# EAGLE design force_sensor_pcb_v2 (EAGLE 9.2.2)
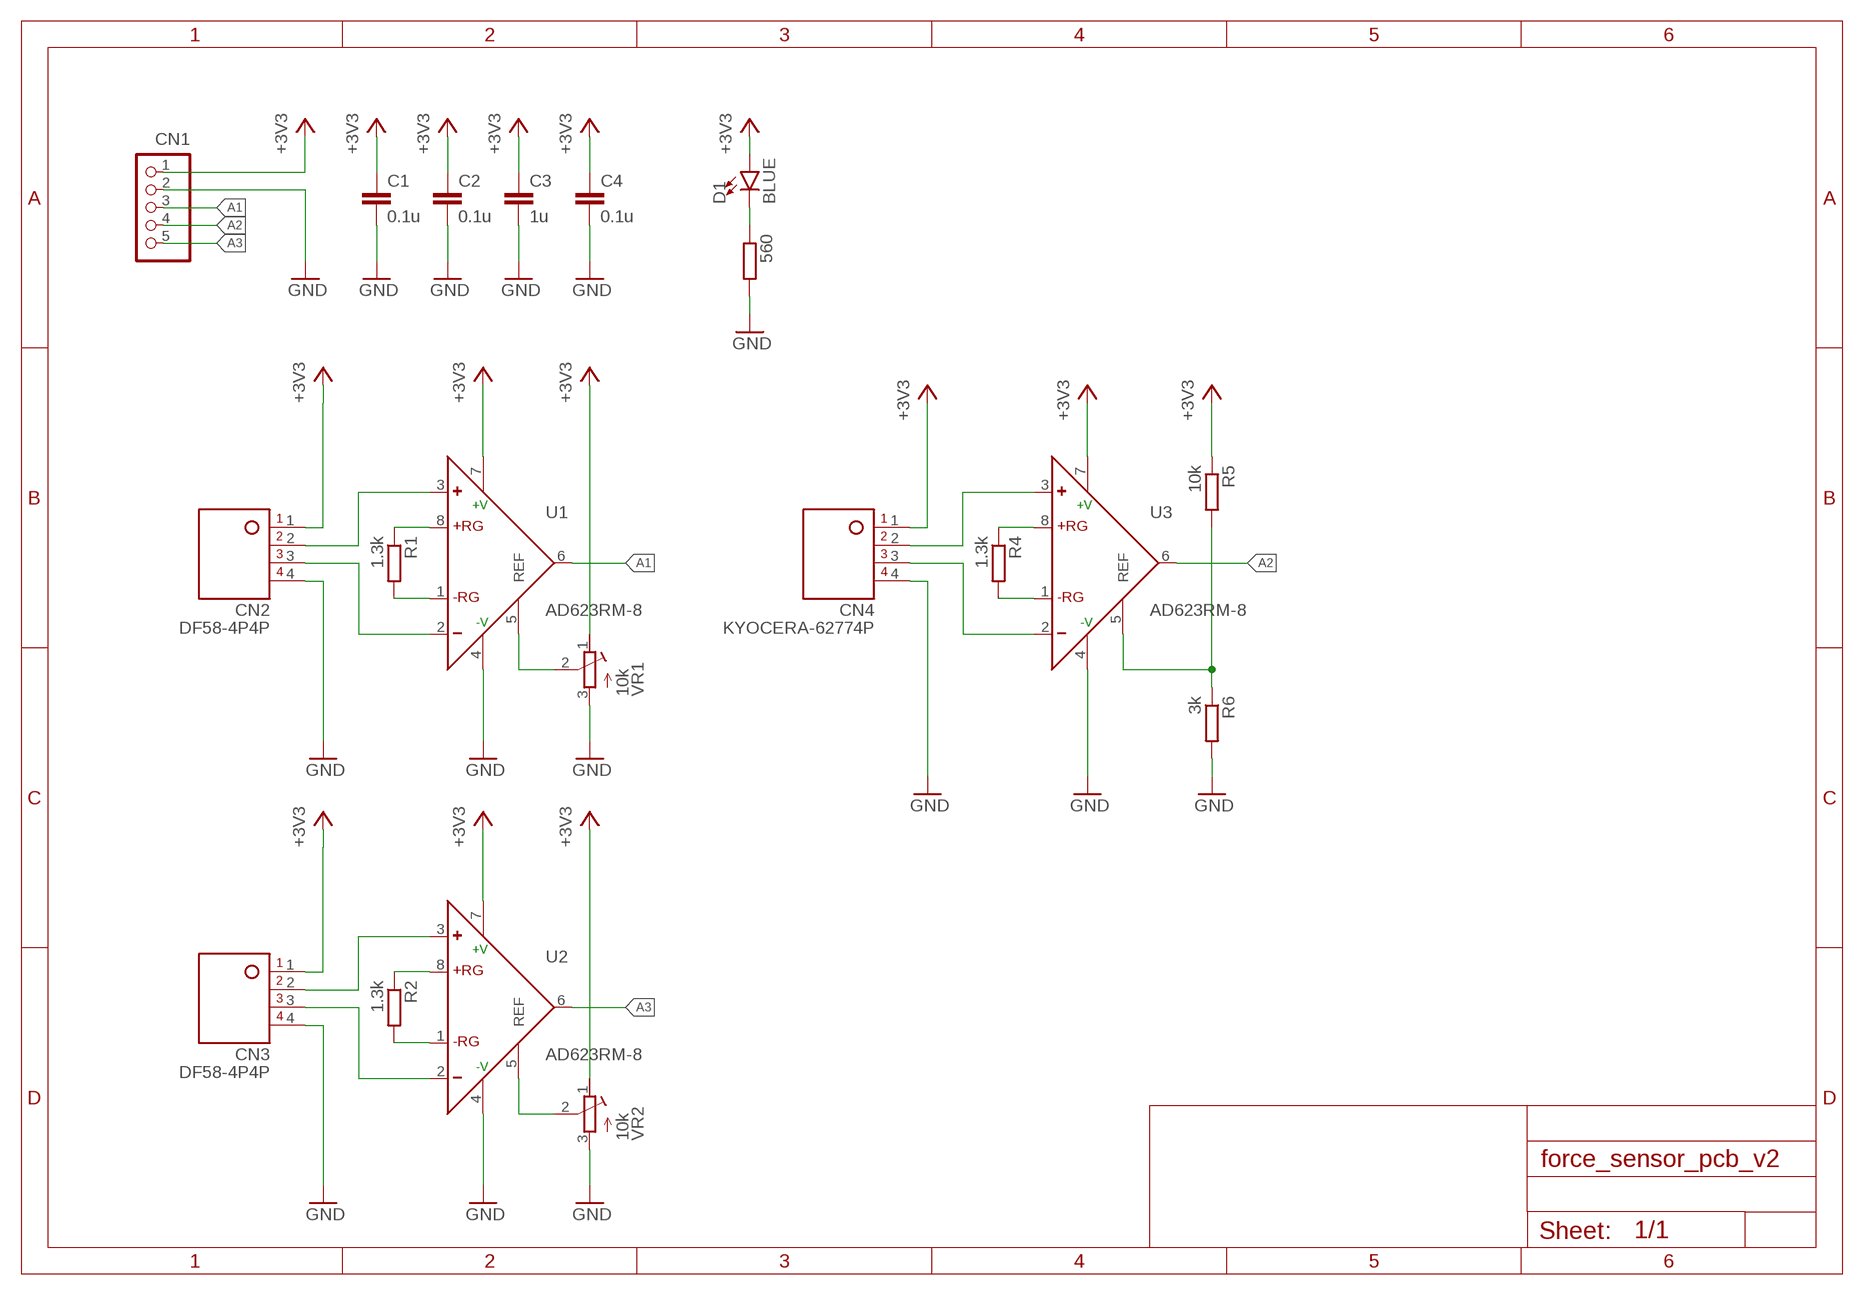
[diagram p0: schematic, sheet 1]

## Parts
560  R-EU_R0603  [R0603]
C1  0.1u  C-EUC0603  [C0603]
C2  0.1u  C-EUC0603  [C0603]
C3  1u  C-EUC0603  [C0603]
C4  0.1u  C-EUC0603  [C0603]
CN1  B5B-PH-K-S  [B5B-PH-K-S]
CN2  DF58-4P4P  [DF58-4P]
CN3  DF58-4P4P  [DF58-4P]
CN4  KYOCERA-62774P  [KYOCERA-6277-4]
D1  BLUE  LED-BLUE0603  [LED-0603]
R1  1.3k  R-EU_R0603  [R0603]
R2  1.3k  R-EU_R0603  [R0603]
R4  1.3k  R-EU_R0603  [R0603]
R5  10k  R-EU_R0603  [R0603]
R6  3k  R-EU_R0603  [R0603]
U1  AD623RM-8  [MSOP08]
U2  AD623RM-8  [MSOP08]
U3  AD623RM-8  [MSOP08]
VR1  10k  D43A  [D43A]
VR2  10k  D43A  [D43A]

## Nets
+3V3: C1.1 C2.1 C3.1 C4.1 CN1.1 CN2.1 CN3.1 CN4.1 D1.A R5.1 U1.7(+V) U2.7(+V) U3.7(+V) VR1.1 VR2.1
A1: CN1.3 U1.6(OUT)
A2: CN1.4 U3.6(OUT)
A3: CN1.5 U2.6(OUT)
GND: 560.2 C1.2 C2.2 C3.2 C4.2 CN1.2 CN2.4 CN3.4 CN4.4 R6.2 U1.4(-V) U2.4(-V) U3.4(-V) VR1.3 VR2.3
N$3: U1.5(REF) VR1.2
N$5: CN2.3 U1.2(-IN)
N$6: R1.1 U1.8(+RG)
N$7: R1.2 U1.1(-RG)
N$8: CN2.2 U1.3(+IN)
N$10: R2.1 U2.8(+RG)
N$11: U2.5(REF) VR2.2
N$12: CN3.3 U2.2(-IN)
N$13: CN3.2 U2.3(+IN)
N$14: R2.2 U2.1(-RG)
N$15: R4.1 U3.8(+RG)
N$16: R5.2 R6.1 U3.5(REF)
N$17: CN4.3 U3.2(-IN)
N$18: CN4.2 U3.3(+IN)
N$19: R4.2 U3.1(-RG)
N$20: 560.1 D1.C

## Library data of the parts
560 R1 R2 R4-R6 = rcl:R-EU_: RESISTOR, European symbol; SPICEPREFIX: R
C1-C4 = rcl:C-EU: CAPACITOR, European symbol; SPICEPREFIX: C
CN1 = jst-ph:B5B-PH-*: Wire-to-Board 2.0mm pitch top mount connector Source: http://www.jst-mfg.com/product/pdf/jpn/PH.pdf http://www.jst-mfg.com/product/detail.php?series=199
CN2 CN3 = yunit-tech_eagle_library:DF58-4P
CN4 = yunit-tech_eagle_library:KYOCERA-6277: 0.5mmピッチ RA STM 両面接点 ワンタッチロック
D1 = yunit-tech_eagle_library:LED-BLUE: Blue SMD LED Used in manufacturing of various products at SparkFun Packages: 0603 - SMD 0603 package [Product Link] <http://www.digikey.com/product-detail/en/SMLE12BC7TT86/511-1589-2-ND/1641808> 1206 - SMD1206 package [Product Link] <http://www.digikey.com/product-detail/en/lite-on-inc/LTST-C150TBKT/160-1643-1-ND/573584> SparkFun Products: ESP8266 Thing-Dev Board <https://www.sparkfun.com/products/13711> RedBoard <https://www.sparkfun.com/products/12757>; PROD_ID: DIO-08575
U1-U3 = yunit-tech_eagle_library:AD623
VR1 VR2 = yunit-tech_eagle_library:D43A

## Board
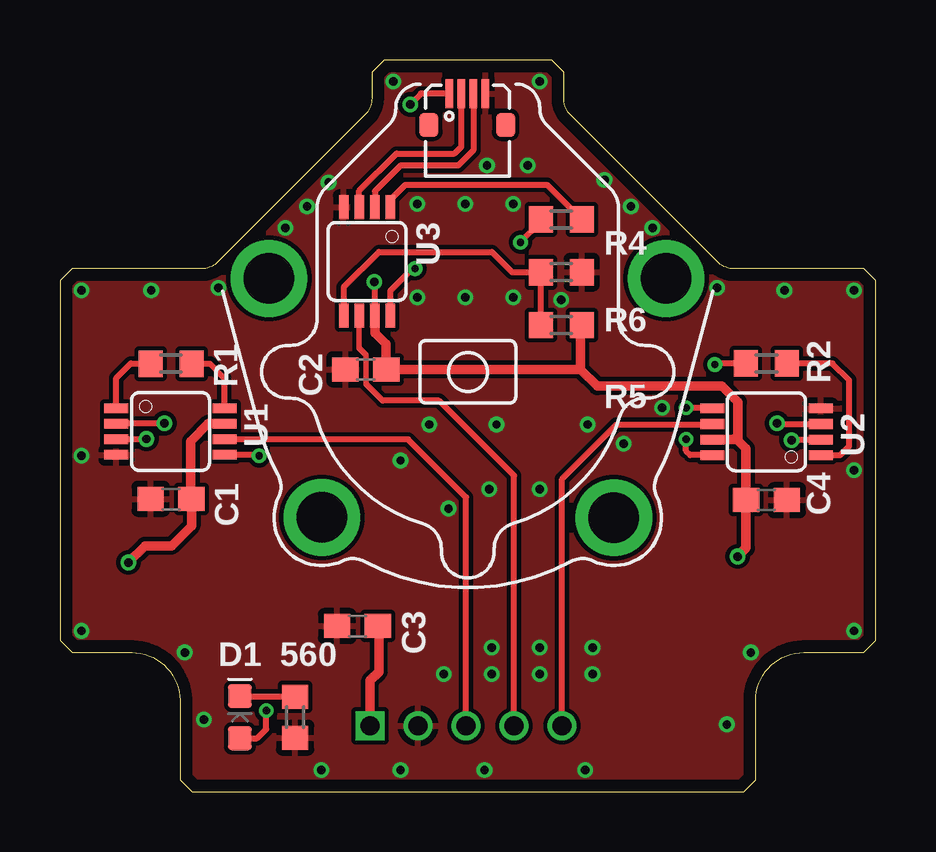
[diagram p1: board, top side]
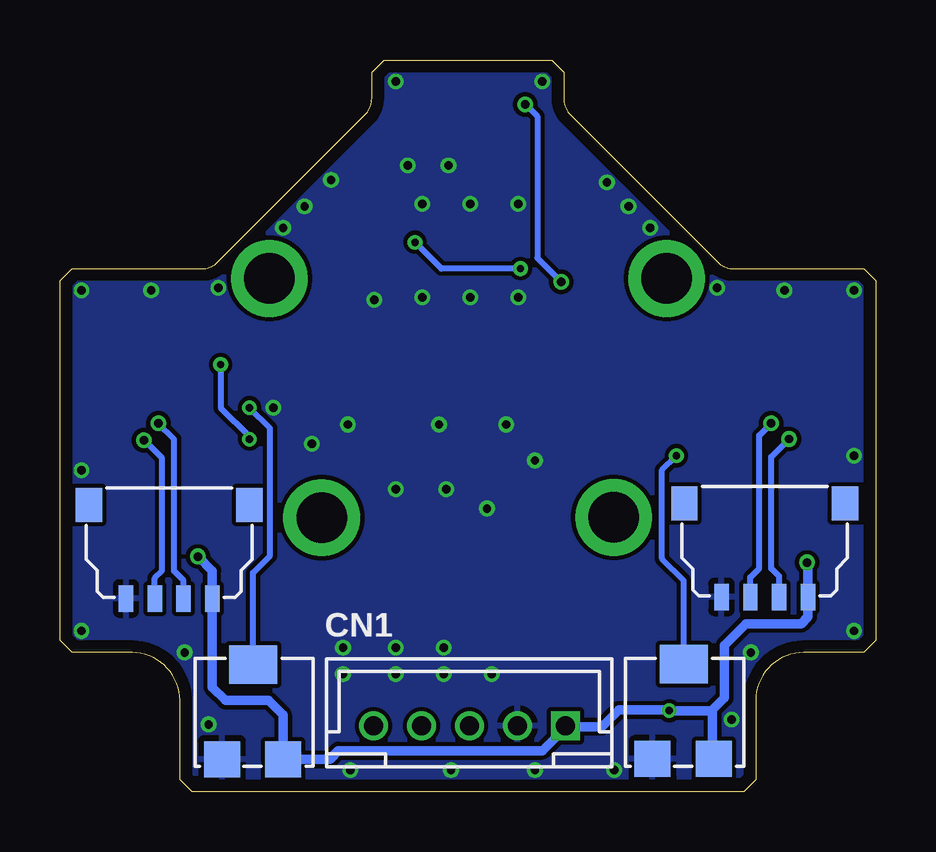
[diagram p2: board, bottom side, seen from below]

Size 34 x 30.5 mm. Coordinates in mm from the lower left corner, seen from the top.
Outline: 28.5,0 29,0.5 29,3.8 arc-90 31,5.8 33.5,5.8 34,6.3 34,21.3 33.5,21.8 28.11,21.8 arc-45 27.4,22.09 21.29,28.2 arc-45 21,28.91 21,30 20.5,30.5 13.5,30.5 13,30 13,28.91 arc-45 12.71,28.2 6.6,22.09 arc-45 5.89,21.8 0.5,21.8 0,21.3 0,6.3 0.5,5.8 3,5.8 arc-90 5,3.8 5,0.5 5.5,0 28.5,0
Copper layers (1*16): Top 0.035mm / dielectric 1.6mm / Bottom 0.035mm
Design rules "Elecrow_2-layer_PCB_eagle_rule": minimum track width 6mil, minimum drill 12mil, track to track 7mil, track to pad 7mil, pad to pad 7mil, via to via 8mil, smd to smd 0mil, copper to edge 20mil, drill to drill 10mil, minimum pad ring 6mil, minimum via ring 6mil, stop-mask expansion 0mil, vias tented up to drill 100mil, thermal gap 10mil

### Footprints (pad centres in the part's own frame; a part is rotated, then mirrored left to right if it is on the bottom)
R0603 = smd 1 x 1.1: 1 -0.85,0; 2 0.85,0
C0603 = smd 1.1 x 1: 1 -0.85,0; 2 0.85,0
B5B-PH-K-S = drill 0.8 square: 1 -4,0 | drill 0.8: 2 -2,0; 3 0,0; 4 2,0; 5 4,0
DF58-4P = smd 0.6 x 1.1: 1 -1.8,4.6; 2 -0.6,4.6; 3 0.6,4.6; 4 1.8,4.6 | smd 1.1 x 1.4: PAD1 -3.35,0.7; PAD2 3.35,0.7
KYOCERA-6277-4 = smd 0.3 x 1.2: 1 -0.75,1.3; 2 -0.25,1.3; 3 0.25,1.3; 4 0.75,1.3 | smd 0.8 x 1: PAD-1 -1.6,0; PAD-2 1.6,0
LED-0603 = smd 1 x 1: A -0.877,0; C 0.877,0
MSOP08 = smd 0.4 x 1: 1 -0.976,-2.263; 2 -0.326,-2.263; 3 0.324,-2.263; 4 0.974,-2.263; 5 0.974,2.262; 6 0.324,2.262; 7 -0.326,2.262; 8 -0.976,2.262
D43A = smd 1.5 x 1.5: 1 1.25,-1.95; 3 -1.3,-1.95 | smd 2 x 1.6: 2 0,2

### Placement (x,y rotation side)
560  9.8,3.1 270 top
C1  4.63,12.2 180 top
C2  12.75,17.6 180 top
C3  12.4,6.9 180 top
C4  29.45,12.15 0 top
CN1  16.93,2.74 180 bottom
CN2  4.62,12.71 180 bottom
CN3  29.45,12.65 180 bottom
CN4  16.98,27.8 0 top
D1  7.5,3.1 90 top
R1  4.63,17.84 180 top
R2  29.45,17.85 0 top
R4  20.9,23.85 0 top
R5  20.9,19.45 180 top
R6  20.9,21.65 0 top
U1  4.61,15.01 270 top
U2  29.45,15 90 top
U3  12.8,22.1 180 top
VR1  8,3.31 0 bottom
VR2  25.95,3.3 0 bottom

### Tracks (layer width: path | path; a pad name or v marks a point on that pad's centre or on a via)
+3V3  (via drill 0.3, 0.35)
  Top 0.25: CN4.1 15.05,29.1 v14.6,28.65 | U3.7 13.13,21.22 v13.1,21.25 | D1.A 8.22,2.22 8.6,2.6 v8.6,3.37
  Top 0.4: U2.7 28.11,14.67 28.17,14.73 28.27,14.63 | 28.27,14.63 28.6,14.3 C4.1 28.6,10.15 v28.25,9.8 | U3.7 13.13,19.12 13.6,18.65 C2.1 21.7,17.6 | U1.7 6.19,15.34 5.45,14.6 5.45,12.23 C1.1 5.48,11.08 4.65,10.25 3.55,10.25 v2.85,9.55 | CN1.1 12.93,4.63 13.3,5 13.3,6.85 C3.1 | 28.27,14.63 28.27,16.23 27.6,16.9 22.4,16.9 21.7,17.6 | 21.7,17.6 21.7,19.4 R5.1
  Bottom 0.25: v13.1,21.25 14.1,22.25 14.1,28.15 v14.6,28.65
  Bottom 0.4: v2.85,9.55 2.82,9.52 CN2.1 2.82,7.28 3.1,7 5.4,7 6.3,6.1 6.3,3.9 6.8,3.4 | v28.25,9.8 27.65,9.2 CN3.1 27.65,4.35 27.1,3.8 25.3,3.8 24.7,3.2 VR2.1 22.75,1.35 22.4,1.7 13.89,1.7 12.89,2.7 | VR1.1 6.8,1.41 6.8,3.4 | 12.89,2.7 11.4,2.7 10.7,3.4 8.63,3.4 v8.6,3.37 6.83,3.37 6.8,3.4 | 12.89,2.7 CN1.1
A1
  Top 0.25: U1.6 14.51,14.69 16.93,12.27 CN1.3
A2
  Top 0.22: U3.6 12.48,18.48 12.76,18.2 12.76,16.98 13.44,16.3 13.46,16.3
  Top 0.25: 13.46,16.3 15.8,16.3 18.93,13.17 CN1.4
A3
  Top 0.25: U2.6 27.16,15.3 23.2,15.3 20.93,13.03 CN1.5
GND  (via drill 0.35)
  other vias: 27.8,2.8 13.9,29.6 20,29.6 17.8,26.1 19.5,26.1 24.7,23.5 23.8,24.4 22.7,25.5 9.4,23.5 10.3,24.4 11.2,25.4 20.9,20.5 16.9,20.6 18.9,24.5 16.9,24.5 6.6,21 0.9,20.9 3.8,20.9 0.9,6.7 0.9,14 33.1,6.7 33.1,20.9 33.1,13.4 27.4,21 30.2,20.9 6,3 28.8,5.8 5.2,5.8 18,4.9 18,6 20,4.9 20,6 22.2,4.9 16,4.9 14.2,13.8 16.2,11.8 15.4,15.3 17.9,12.6 20,12.6 18.2,15.3 23.5,14.5 25.1,16 22,15.3 22.2,6 10.9,0.9 21.9,0.9 17.7,0.9 14.2,0.9 18.9,20.6 14.9,24.5 14.9,20.6
  pour Top: 0,0 34,0 34,30.5 0,30.5
  pour Bottom: 0,0 34,0 34,31.4 0,31.4
N$1  (via drill 2.1 pad 3.2)
  other vias: 23.09,11.42
N$2  (via drill 2.1 pad 3.2)
  other vias: 10.92,11.43
N$3  (via drill 0.3)
  Top 0.25: v8.3,14 8.26,14.04 U1.5
  Bottom 0.25: VR1.2 8,8.8 8.9,9.7 8.9,13.4 v8.3,14
N$4  (via drill 2.1 pad 3.2)
  other vias: 8.71,21.39
N$5  (via drill 0.35)
  Top 0.25: v4.35,15.35 2.36,15.35 U1.2
  Bottom 0.25: CN2.3 5.22,8.93 4.85,9.3 4.85,14.85 v4.35,15.35
N$6
  Top 0.25: R1.1 6.26,17.84 6.85,17.25 6.85,16.01 U1.8
N$7
  Top 0.25: U1.1 2.35,17.25 2.95,17.85 R1.2
N$8  (via drill 0.35)
  Top 0.25: v3.6,14.7 3.59,14.69 U1.3
  Bottom 0.25: CN2.2 4.02,8.97 4.35,9.3 4.35,13.95 v3.6,14.7
N$9  (via drill 2.1 pad 3.2)
  other vias: 25.27,21.39
N$10  (via drill 0.3)
  Top 0.25: R2.1 27.35,17.85 v27.3,17.8 | U2.8 26.28,14.02 26.1,14.2 v26.1,14.69
  Bottom 0.25: v27.3,17.8 27.3,15.99 26.1,14.79 v26.1,14.69
N$11  (via drill 0.3)
  Top 0.25: U2.5 27.16,16 v26.1,16
  Bottom 0.25: VR2.2 25.95,9.12 25.25,9.82 25.25,15.15 v26.1,16
N$12  (via drill 0.35)
  Top 0.25: v30.5,14.65 30.52,14.67 U2.2
  Bottom 0.25: CN3.3 30.05,8.9 29.75,9.2 29.75,13.9 v30.5,14.65
N$13  (via drill 0.35)
  Top 0.25: v29.9,15.35 29.93,15.32 U2.3
  Bottom 0.25: CN3.2 28.85,8.8 29.25,9.2 29.25,14.7 v29.9,15.35
N$14
  Top 0.25: U2.1 32.52,14.02 32.9,14.4 32.9,17.15 32.2,17.85 R2.2
N$15  (via drill 0.3)
  Top 0.25: U3.8 13.78,20.88 14.7,21.8 v14.8,21.8 | v19.2,22.9 20.05,23.75 R4.1
  Bottom 0.25: v14.8,21.8 18.1,21.8 v19.2,22.9
N$16
  Top 0.25: U3.5 11.83,21.03 13.3,22.5 18,22.5 18.85,21.65 R6.1 R5.2
N$17
  Top 0.25: CN4.3 17.23,26.73 16.6,26.1 14.2,26.1 13.13,25.03 U3.2
N$18
  Top 0.25: U3.3 12.48,25.05 14.03,26.6 16.45,26.6 16.73,26.88 CN4.2
N$19
  Top 0.25: U3.1 13.78,24.68 14.4,25.3 20.3,25.3 R4.2
N$20
  Top 0.25: D1.C 9.77,3.98 560.1